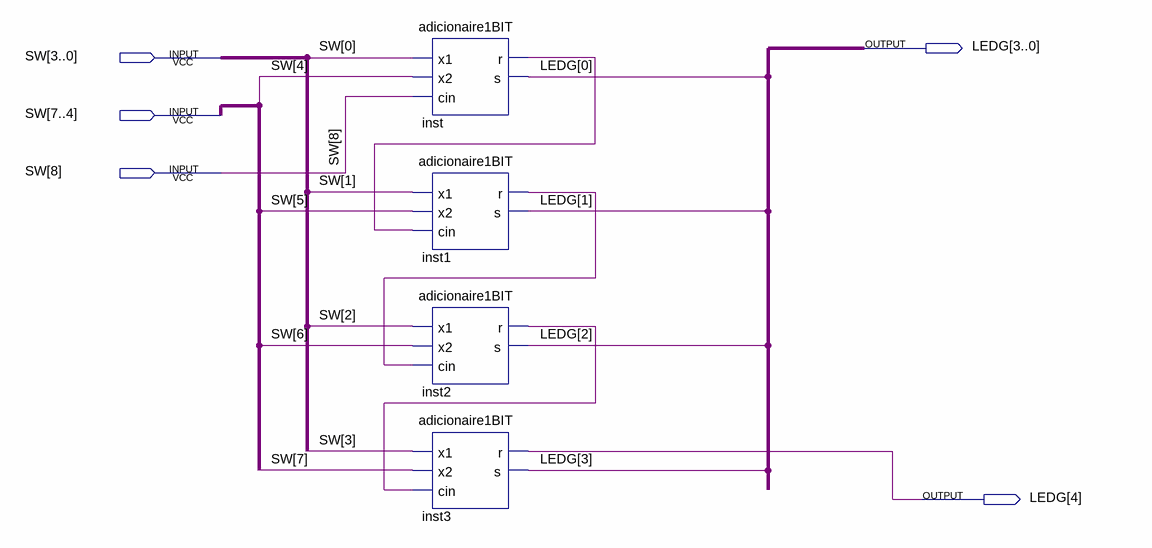
[diagram p0: schematic sheet]
// Quartus schematic adicionaire50.bdf as structural Verilog: 4 symbols, 5 pins
module adicionaire50 (
  input  [8:0] SW,
  output [4:0] LEDG
);

  wire inst1_r, inst2_r, inst_r;

  adicionaire1BIT inst (.x1(SW[0]), .x2(SW[4]), .cin(SW[8]), .r(inst_r), .s(LEDG[0]));
  adicionaire1BIT inst1 (.x1(SW[1]), .x2(SW[5]), .cin(inst_r), .r(inst1_r), .s(LEDG[1]));
  adicionaire1BIT inst2 (.x1(SW[2]), .x2(SW[6]), .cin(inst1_r), .r(inst2_r), .s(LEDG[2]));
  adicionaire1BIT inst3 (.x1(SW[3]), .x2(SW[7]), .cin(inst2_r), .r(LEDG[4]), .s(LEDG[3]));
endmodule
